# EAGLE design rpi_ad7705 (EAGLE 6.6.0)
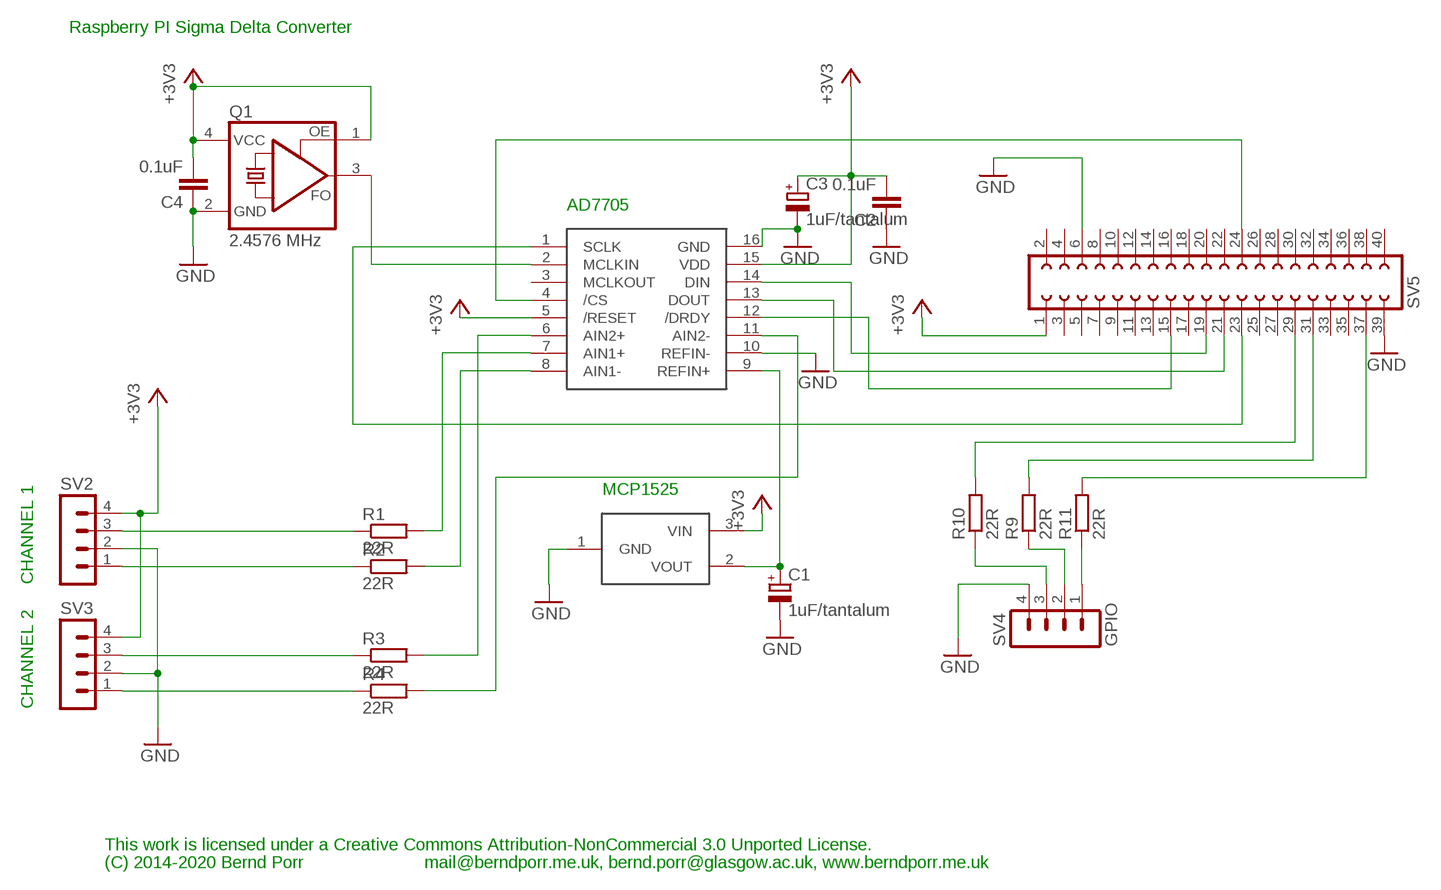
[diagram p0: schematic, sheet 1]

## Parts
C1  1uF/tantalum  CPOL-EUTT2D7  [TT2D7]
C2  0.1uF  C5/2.5  [C5B2.5]
C3  1uF/tantalum  CPOL-EUTT2D7  [TT2D7]
C4  0.1uF  C5/2.5  [C5B2.5]
Q1  2.4576 MHz  ASFL  [ASF]
R1  22R  R-EU_0207/10  [0207/10]
R2  22R  R-EU_0207/10  [0207/10]
R3  22R  R-EU_0207/10  [0207/10]
R4  22R  R-EU_0207/10  [0207/10]
R9  22R  R-EU_0207/10  [0207/10]
R10  22R  R-EU_0207/10  [0207/10]
R11  22R  R-EU_0207/10  [0207/10]
SV2  MA04-1  [MA04-1]
SV3  MA04-1  [MA04-1]
SV4  GPIO  MA04-1  [MA04-1]
SV5  FE20-2  [FE20-2]
U$1  AD7705  [DIP16]
U$2  MCP1525  [TO92]

## Nets
+3V3: C2.2 C3.+ C4.2 Q1.1(OE) Q1.4(VCC) SV2.4 SV3.4 SV5.1 U$1.5(/RESET) U$1.15(VDD) U$2.3(VIN)
GND: C1.- C2.1 C3.- C4.1 Q1.2(GND) SV2.2 SV3.2 SV4.4 SV5.6 SV5.39 U$1.10(REFIN-) U$1.16(GND) U$2.1(GND)
N$1: SV5.19 U$1.14(DIN)
N$2: SV5.23 U$1.1(SCLK)
N$3: Q1.3(FO) U$1.2(MCLKIN)
N$4: SV5.24 U$1.4(/CS)
N$5: R11.2 SV5.37
N$6: SV5.21 U$1.13(DOUT)
N$7: R2.2 U$1.8(AIN1-)
N$8: R1.2 U$1.7(AIN1+)
N$9: R3.2 U$1.6(AIN2+)
N$10: R4.2 U$1.11(AIN2-)
N$11: R1.1 SV2.3
N$12: R2.1 SV2.1
N$13: R3.1 SV3.3
N$14: R4.1 SV3.1
N$15: R10.1 SV4.3
N$16: R9.2 SV5.31
N$17: R10.2 SV5.29
N$19: R11.1 SV4.1
N$20: R9.1 SV4.2
N$21: SV5.15 U$1.12(/DRDY)
N$22: C1.+ U$1.9(REFIN+) U$2.2(VOUT)
Unconnected: SV5.2 SV5.3 SV5.4 SV5.5 SV5.7 SV5.8 SV5.9 SV5.10 SV5.11 SV5.12 SV5.13 SV5.14 SV5.16 SV5.17 SV5.18 SV5.20 SV5.22 SV5.25 SV5.26 SV5.27 SV5.28 SV5.30 SV5.32 SV5.33 SV5.34 SV5.35 SV5.36 SV5.38 SV5.40 U$1.3(MCLKOUT)

## Notes on the sheet
- Raspberry PI Sigma Delta Converter
- AD7705
- MCP1525
- CHANNEL 1
- CHANNEL 2
- This work is licensed under a Creative Commons Attribution-NonCommercial 3.0 Unported License.
- (C) 2014-2020 Bernd Porr | mail@berndporr.me.uk, bernd.porr@glasgow.ac.uk, www.berndporr.me.uk

## Library data of the parts
C1 C3 = rcl:CPOL-EU: POLARIZED CAPACITOR, European symbol
C2 C4 = capacitor-wima:C: CAPACITOR naming: grid - package width
Q1 = crystal:ASF*: CRYSTAL CLOCK OSCILLATORS 5.0 Vdc or 3.3 Vdc - LOW PROFILE ULTRA MINIATURE CERAMIC SURFACE MOUNT Source: http://www.abracon.com/Oscillators/asf1-L-L1.pdf; MPN: ASFLM1-50.000MHZ-C-T; OC_FARNELL: 1838931; OC_NEWARK: 99M0411
R1-R4 R9-R11 = resistor:R-EU_: RESISTOR, European symbol
SV2-SV4 = con-lstb:MA04-1: PIN HEADER; OC_FARNELL: unknown; OC_NEWARK: unknown
SV5 = con-lsta:FE20-2: FEMALE HEADER; OC_FARNELL: unknown; OC_NEWARK: unknown
U$1 = rpi:AD7705
U$2 = rpi:MCP1525

## Board
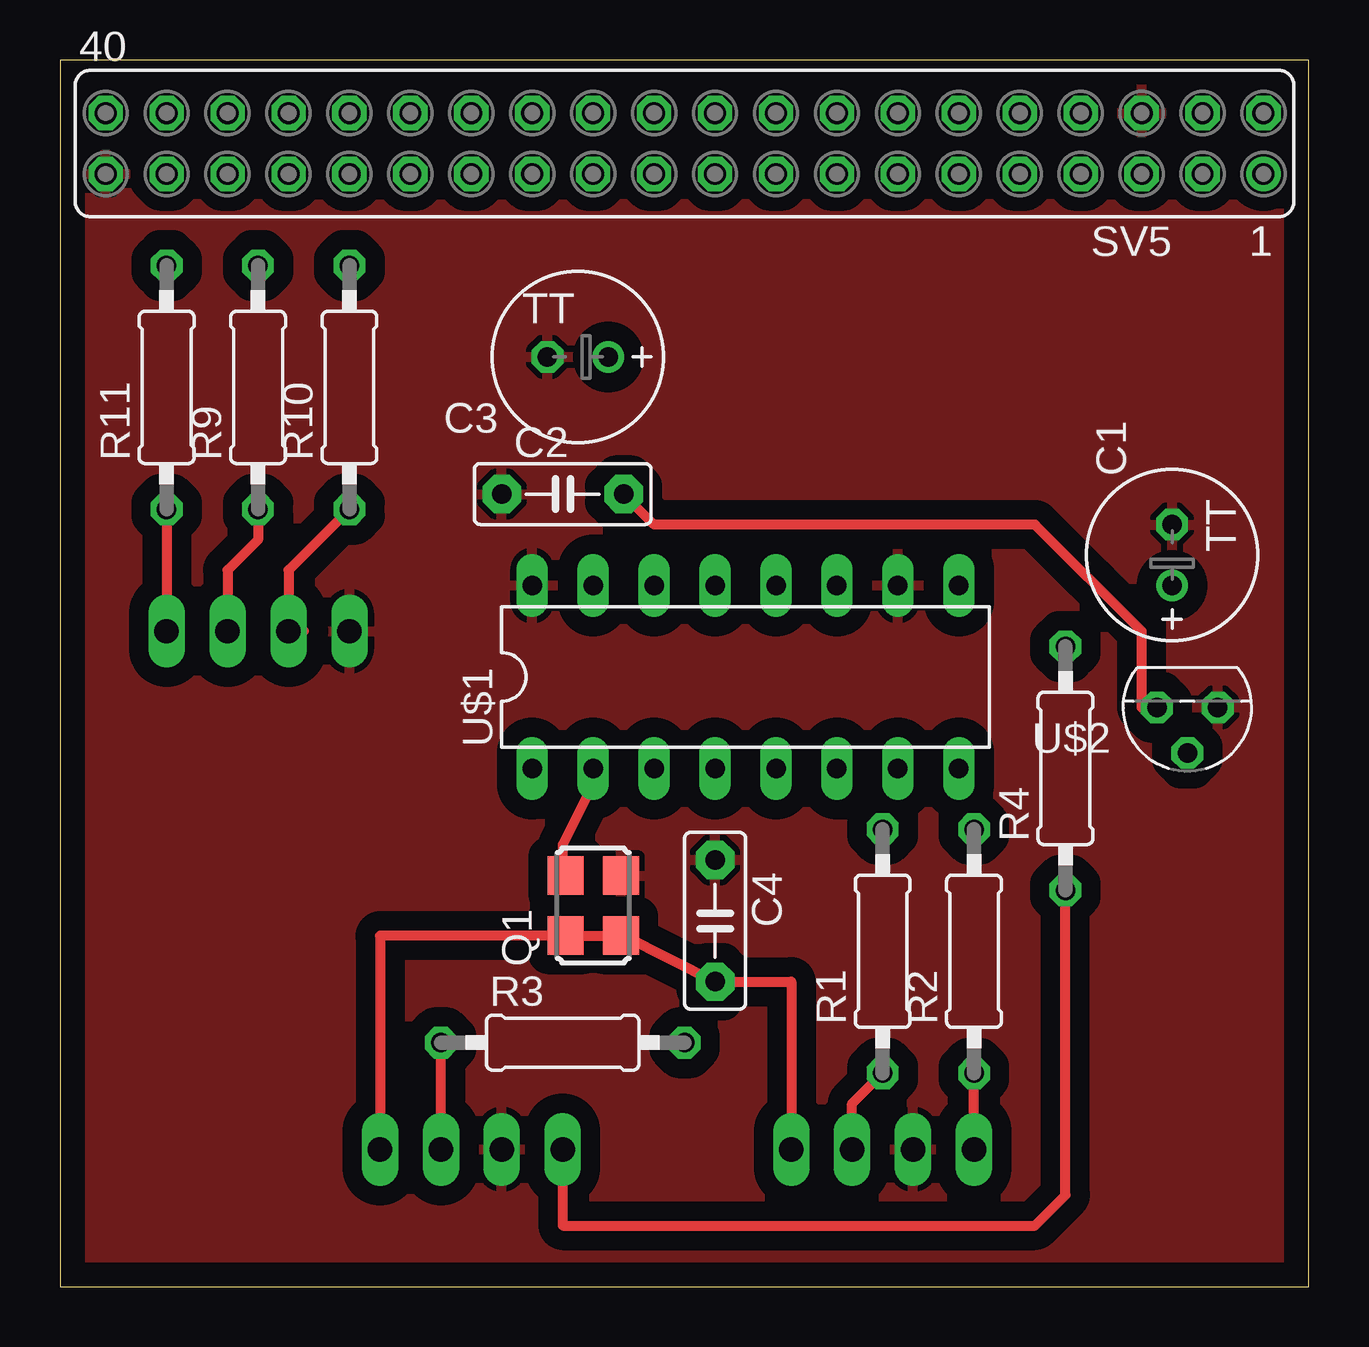
[diagram p1: board, top side]
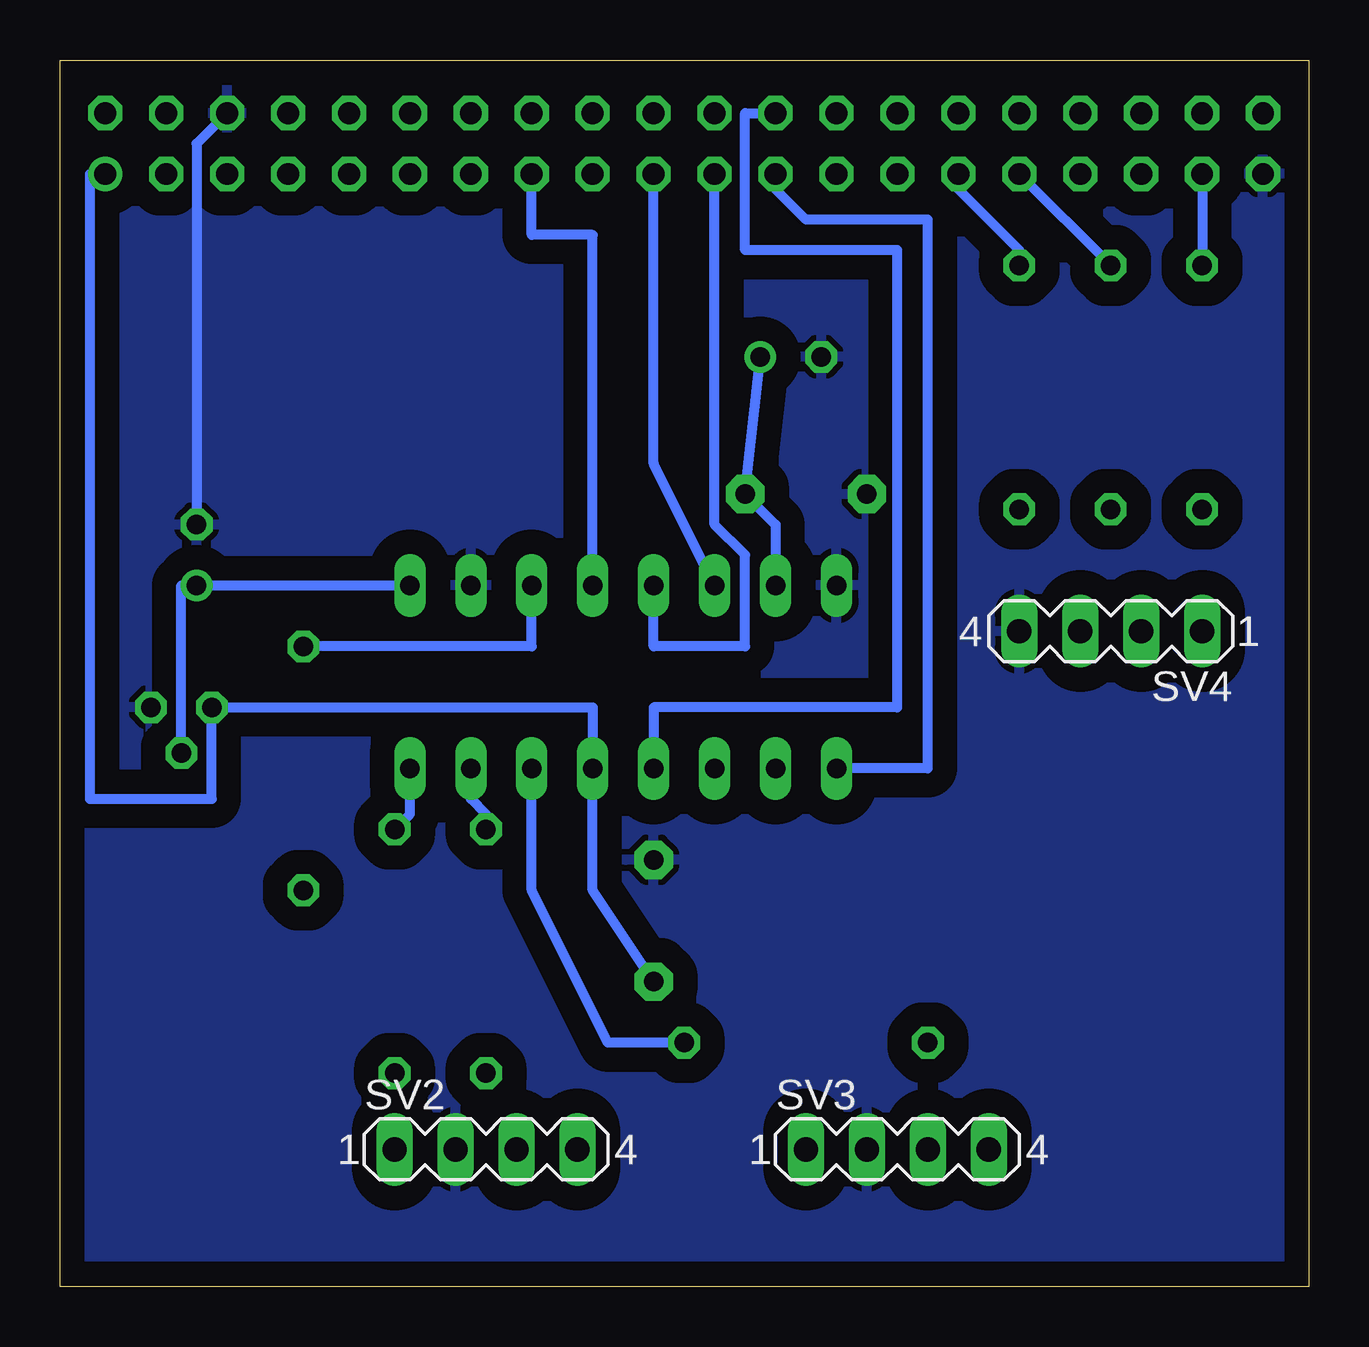
[diagram p2: board, bottom side, seen from below]

Size 52.05 x 51.1 mm. Coordinates in mm from the lower left corner, seen from the top.
Outline: 0,0 52.05,0 52.05,51.1 0,51.1 0,0
Copper layers (1*16): Top 0.035mm / dielectric 1.5mm / Bottom 0.035mm
Design rules "default": minimum track width 10mil, minimum drill 24mil, track to track 8mil, track to pad 8mil, pad to pad 8mil, via to via 8mil, smd to smd 8mil, copper to edge 40mil, drill to drill 8mil, minimum pad ring 10mil, minimum via ring 8mil, stop-mask expansion 4mil, vias tented up to drill 0mil, thermal gap 10mil

### Footprints (pad centres in the part's own frame; a part is rotated, then mirrored left to right if it is on the bottom)
TT2D7 = drill 0.813: + -1.27,0 | drill 0.813 octagon: - 1.27,0
C5B2.5 = drill 0.813 pad 1.6 octagon: 1 -2.54,0; 2 2.54,0
ASF = smd 1.6 x 1.5: 1 -1.25,-1.15; 2 1.25,-1.15; 3 1.25,1.15; 4 -1.25,1.15
0207/10 = drill 0.813 octagon: 1 -5.08,0; 2 5.08,0
MA04-1 = drill 1.016 long: 1 -3.81,0; 2 -1.27,0; 3 1.27,0; 4 3.81,0
FE20-2 = drill 0.914: 1 -24.13,1.27 | drill 0.914 octagon: 2 -24.13,-1.27; 3 -21.59,1.27; 4 -21.59,-1.27; 5 -19.05,1.27; 6 -19.05,-1.27; 7 -16.51,1.27; 8 -16.51,-1.27; 9 -13.97,1.27; 10 -13.97,-1.27; 11 -11.43,1.27; 12 -11.43,-1.27; 13 -8.89,1.27; 14 -8.89,-1.27; 15 -6.35,1.27; 16 -6.35,-1.27; 17 -3.81,1.27; 18 -3.81,-1.27; 19 -1.27,1.27; 20 -1.27,-1.27; 21 1.27,1.27; 22 1.27,-1.27; 23 3.81,1.27; 24 3.81,-1.27; 25 6.35,1.27; 26 6.35,-1.27; 27 8.89,1.27; 28 8.89,-1.27; 29 11.43,1.27; 30 11.43,-1.27; 31 13.97,1.27; 32 13.97,-1.27; 33 16.51,1.27; 34 16.51,-1.27; 35 19.05,1.27; 36 19.05,-1.27; 37 21.59,1.27; 38 21.59,-1.27; 39 24.13,1.27; 40 24.13,-1.27
DIP16 = drill 0.813 long: 1 -8.89,-3.81; 2 -6.35,-3.81; 3 -3.81,-3.81; 4 -1.27,-3.81; 5 1.27,-3.81; 6 3.81,-3.81; 7 6.35,-3.81; 8 8.89,-3.81; 9 8.89,3.81; 10 6.35,3.81; 11 3.81,3.81; 12 1.27,3.81; 13 -1.27,3.81; 14 -3.81,3.81; 15 -6.35,3.81; 16 -8.89,3.81
TO92 = drill 0.813 octagon: 1 -3.81,0; 2 -2.54,1.905; 3 -1.27,0

### Placement (x,y rotation side)
C1  46.35,30.48 90 top
C2  20.96,33.02 0 top
C3  21.59,38.73 180 top
C4  27.31,15.24 270 top
Q1  22.23,15.88 90 top
R1  34.29,13.97 90 top
R2  38.1,13.97 90 top
R3  20.96,10.16 0 top
R4  41.91,21.59 90 top
R9  8.26,37.47 90 top
R10  12.06,37.47 90 top
R11  4.45,37.47 90 top
SV2  34.29,5.71 0 bottom
SV3  17.15,5.71 0 bottom
SV4  8.26,27.3 180 bottom
SV5  26.04,47.62 180 top
U$1  28.58,25.4 0 top
U$2  44.45,24.13 180 top

### Tracks (layer width: path | path; a pad name or v marks a point on that pad's centre or on a via)
+3V3
  Top 0.406: U$2.3 45.09,24.13 45.09,27.3 40.64,31.75 24.77,31.75 C2.2 | SV3.4 13.33,14.61 13.36,14.62 Q1.4 Q1.1 23.52,14.62 C4.2 30.48,12.7 SV2.4
  Bottom 0.406: C3.+ C2.2 22.23,31.75 U$1.15 | C4.2 29.85,16.51 U$1.5 29.85,24.13 U$2.3 45.72,20.32 50.8,20.32 50.8,46.35 SV5.1
GND
  Bottom 0.406: SV5.6 46.35,47.62 C1.-
  pour Bottom (isolate 1.016): 0.64,50.16 51.43,50.16 51.43,1.27 0.64,1.27
  pour Top (isolate 0.813): 0.64,50.16 51.43,50.16 51.43,0.64 0.64,0.64
N$1
  Bottom 0.406: U$1.14 27.31,34.29 SV5.19
N$2
  Bottom 0.406: U$1.1 15.88,21.59 15.88,44.45 20.96,44.45 22.23,45.72 SV5.23
N$3
  Top 0.406: U$1.2 22.23,20.95 20.96,18.41 20.96,17.25 Q1.3
N$4
  Bottom 0.406: U$1.4 27.31,24.13 17.15,24.13 17.15,43.18 23.5,43.18 23.5,48.9 SV5.24
N$5
  Bottom 0.406: SV5.37 R11.2
N$6
  Bottom 0.406: U$1.13 27.31,26.67 23.5,26.67 23.5,30.48 24.77,31.75 SV5.21
N$7
  Bottom 0.406: R2.2 37.46,19.68 U$1.8
N$8
  Bottom 0.406: R1.2 34.29,19.68 34.92,20.32 U$1.7
N$9
  Bottom 0.406: R3.2 29.21,10.16 32.38,16.51 U$1.6
N$10
  Bottom 0.406: R4.2 32.38,26.67 U$1.11
N$11
  Top 0.406: SV2.3 33.02,7.62 R1.1
N$12
  Top 0.406: SV2.1 R2.1
N$13
  Top 0.406: SV3.3 R3.1
N$14
  Top 0.406: SV3.1 20.96,2.54 40.64,2.54 41.91,3.81 R4.1
N$15
  Top 0.406: R10.1 9.53,29.84 9.53,27.94 10.16,27.3 SV4.3
N$16
  Bottom 0.406: R9.2 SV5.31
N$17
  Bottom 0.406: R10.2 12.06,43.18 14.61,45.72 SV5.29
N$19
  Top 0.406: R11.1 SV4.1 4.45,26.67
N$20
  Top 0.406: R9.1 8.26,31.11 6.98,29.84 SV4.2
N$21
  Bottom 0.406: U$1.12 29.85,43.81 32.38,43.81 SV5.15
N$22
  Bottom 0.406: U$1.9 C1.+ 46.99,29.21 U$2.2